# Altium project KOTROLER_TRANSPORTA.PrjPcb (part 1 of 2)
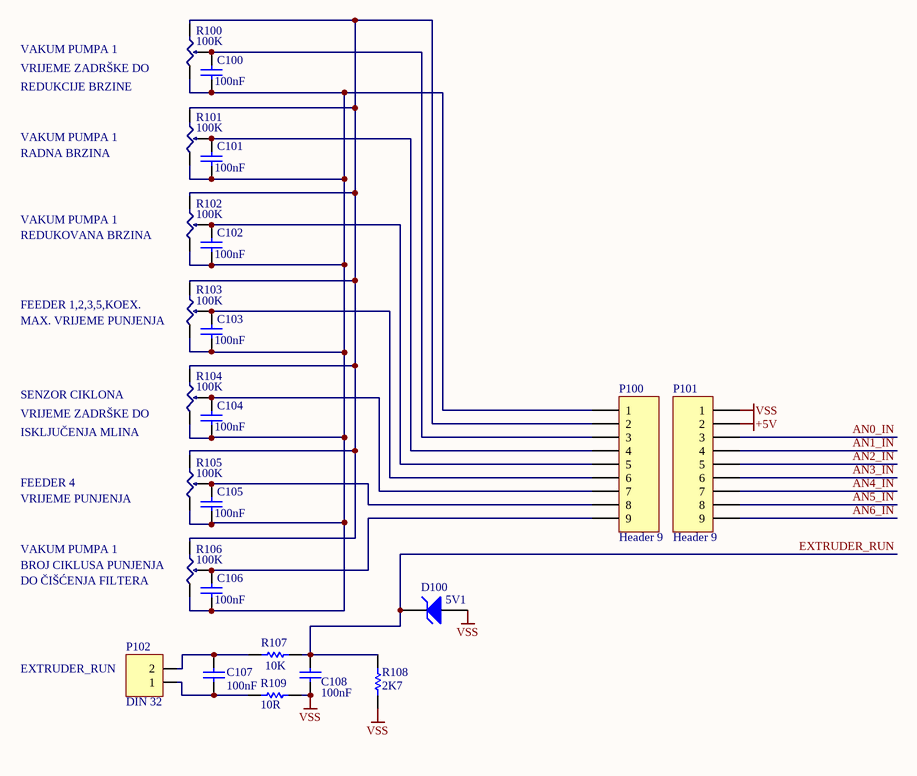
[diagram p0: ANALOG_INPUT.SchDoc]
8 sheets, 436 parts. Net scope: global (net labels, ports and power ports of the same name join across sheets).
Board file: KOTROLER_TRANSPORTA.PcbDoc
Sheets:
  ANALOG_INPUT.SchDoc
  ANALOG_OUTPUT.SchDoc
  CUC.SchDoc
  DIGITAL_INPUT.SchDoc
  DIGITAL_OUTPUT.SchDoc
  PSU.SchDoc
  SIGNAL_OUTPUT.SchDoc
  ERROR_DISPLAY.SchDoc

## Sheet ANALOG_INPUT.SchDoc: Analog input
size A4; Author: eldar6776@hotmail.com; DrawnBy: Eldar Dedic; Organization: PROVEN d.o.o.; Address1: Adema Buće 102; Address2: 71000 Sarajevo; Address3: Federacija BiH; Address4: Bosna i Hercegovina; DocumentNumber: CD-26514; Revision: 001; SheetNumber: 1; SheetTotal: 8; ProjectName: KONTROLER TRANSPORTA MATERIJALA

### Parts
C100  value 100nF  [1206]
C101  value 100nF  [1206]
C102  value 100nF  [1206]
C103  value 100nF  [1206]
C104  value 100nF  [1206]
C105  value 100nF  [1206]
C106  value 100nF  [1206]
C107  value 100nF  [1206]
C108  value 100nF  [1206]
D100  5V1  [SOD80C]
P100  Header 9  [HDR1X9]
P101  Header 9  [HDR1X9]
P102  DIN 32  [TERMINAL BLOK 2]
R100  100K  [Poti]
R101  100K  [Poti]
R102  100K  [Poti]
R103  100K  [Poti]
R104  100K  [Poti]
R105  100K  [Poti]
R106  100K  [Poti]
R107  10K  [ERA-0805]
R108  2K7  [ERA-0805]
R109  10R  [ERA-0805]

### Nets
+5V: P101.2
VSS: C108.2 D100.1(A) P101.1 R108.2 R109.1
AN0_IN: P101.3
AN1_IN: P101.4
AN2_IN: P101.5
AN3_IN: P101.6
AN4_IN: P101.7
AN5_IN: P101.8
AN6_IN: P101.9
EXTRUDER_RUN: C108.1 D100.2(K) R107.1 R108.1
NetC100_1: C100.1 C101.1 C102.1 C103.1 C104.1 C105.1 C106.1 P100.1 R100.2 R101.2 R102.2 R103.2 R104.2 R105.2 R106.2
NetC100_2: C100.2 P100.3 R100.3
NetC101_2: C101.2 P100.4 R101.3
NetC102_2: C102.2 P100.5 R102.3
NetC103_2: C103.2 P100.6 R103.3
NetC104_2: C104.2 P100.7 R104.3
NetC105_2: C105.2 P100.8 R105.3
NetC106_2: C106.2 P100.9 R106.3
NetC107_1: C107.1 P102.2 R107.2
NetC107_2: C107.2 P102.1 R109.2
NetP100_2: P100.2 R100.1 R101.1 R102.1 R103.1 R104.1 R105.1 R106.1

### Notes on the sheet
- VAKUM PUMPA 1
- VRIJEME ZADRŠKE DO
- REDUKCIJE BRZINE
- RADNA BRZINA
- REDUKOVANA BRZINA
- FEEDER 1,2,3,5,KOEX.
- MAX. VRIJEME PUNJENJA
- SENZOR CIKLONA
- ISKLJUČENJA MLINA
- FEEDER 4
- VRIJEME PUNJENJA
- BROJ CIKLUSA PUNJENJA
- DO ČIŠĆENJA FILTERA
- EXTRUDER_RUN
- Title
- Size:
- Date:
- A4
- Number:
- Time:
- Revision:
- Sheet
- of
- File:

### Library data of the parts
C100-C108 = C1206: Ceramic Chip Capacitor - Standard; Published: 17-Jul-2002; LatestRevisionDate: 19-Mar-2004; LatestRevisionNote: Silkscreen size reduced.; DatasheetDocument: Mar-2001; PackageDocument: Mar-2001; PackageReference: 1206; Publisher: Altium Limited; Code_JEITA: 1206; Code_IPC: 3216 [1206]; ComponentLink1Description: Manufacturer Link; ComponentLink1URL: http://www.kemet.com/; ComponentLink2Description: Datasheet; ComponentLink2URL: http://www.kemet.com/kemet/web/homepage/kechome.nsf/vapubfilesname/F3102TA.pdf/$file/F3102TA.pdf
D100 = D Zener: Zener Diode; Published: 8-Jun-2000; LatestRevisionDate: 17-Jul-2002; LatestRevisionNote: Re-released for DXP Platform.; PackageReference: DIODE-0.7; Publisher: Altium Limited; PackageDescription: Diode, Thru-Hole; 2 Leads; 0.7 in Pin Spacing
P100 P101 = Header 9: Header, 9-Pin; LatestRevisionDate: 17-Jul-2002; LatestRevisionNote: Re-released for DXP Platform.; Publisher: Altium Limited
P102 = Terminal blok 2 pina: Terminal blok 2
R100-R106 = POTI
R107-R109 = ERA6Y: Rectangular Thick Film Chip Resistor, 10 Ohm to 1M Ohm Range, 0.1% and 0.5% Tolerance, 0805 Size, 0.1 W; Note: If flow soldering, adjust pad width of PCB Footprint to 0.7 - 0.8 times the width of the resistor.; Published: 17-Dec-2003; LatestRevisionDate: 19-Mar-2004; LatestRevisionNote: Silkscreen size reduced.; PackageDocument: Mar-2003; PackageReference: ERA-0805; Publisher: Altium Limited; Code_IPC: 2012 [0805]; ComponentLink1Description: Manufacturer Link; ComponentLink1URL: http://www.panasonic.com/industrial/components/resistive_products.htm; ComponentLink2Description: Datasheet; ComponentLink2URL: http://www.panasonic.com/industrial/components/pdf/AOA0000CE8.pdf

## Sheet ANALOG_OUTPUT.SchDoc: Analog output
size A4; Author: eldar6776@hotmail.com; DrawnBy: Eldar Dedic; Organization: PROVEN d.o.o.; Address1: Adema Buće 102; Address2: 71000 Sarajevo; Address3: Federacija BiH; Address4: Bosna i Hercegovina; DocumentNumber: CD-26514; Revision: 001; SheetNumber: 2; SheetTotal: 8; ProjectName: KONTROLER TRANSPORTA MATERIJALA
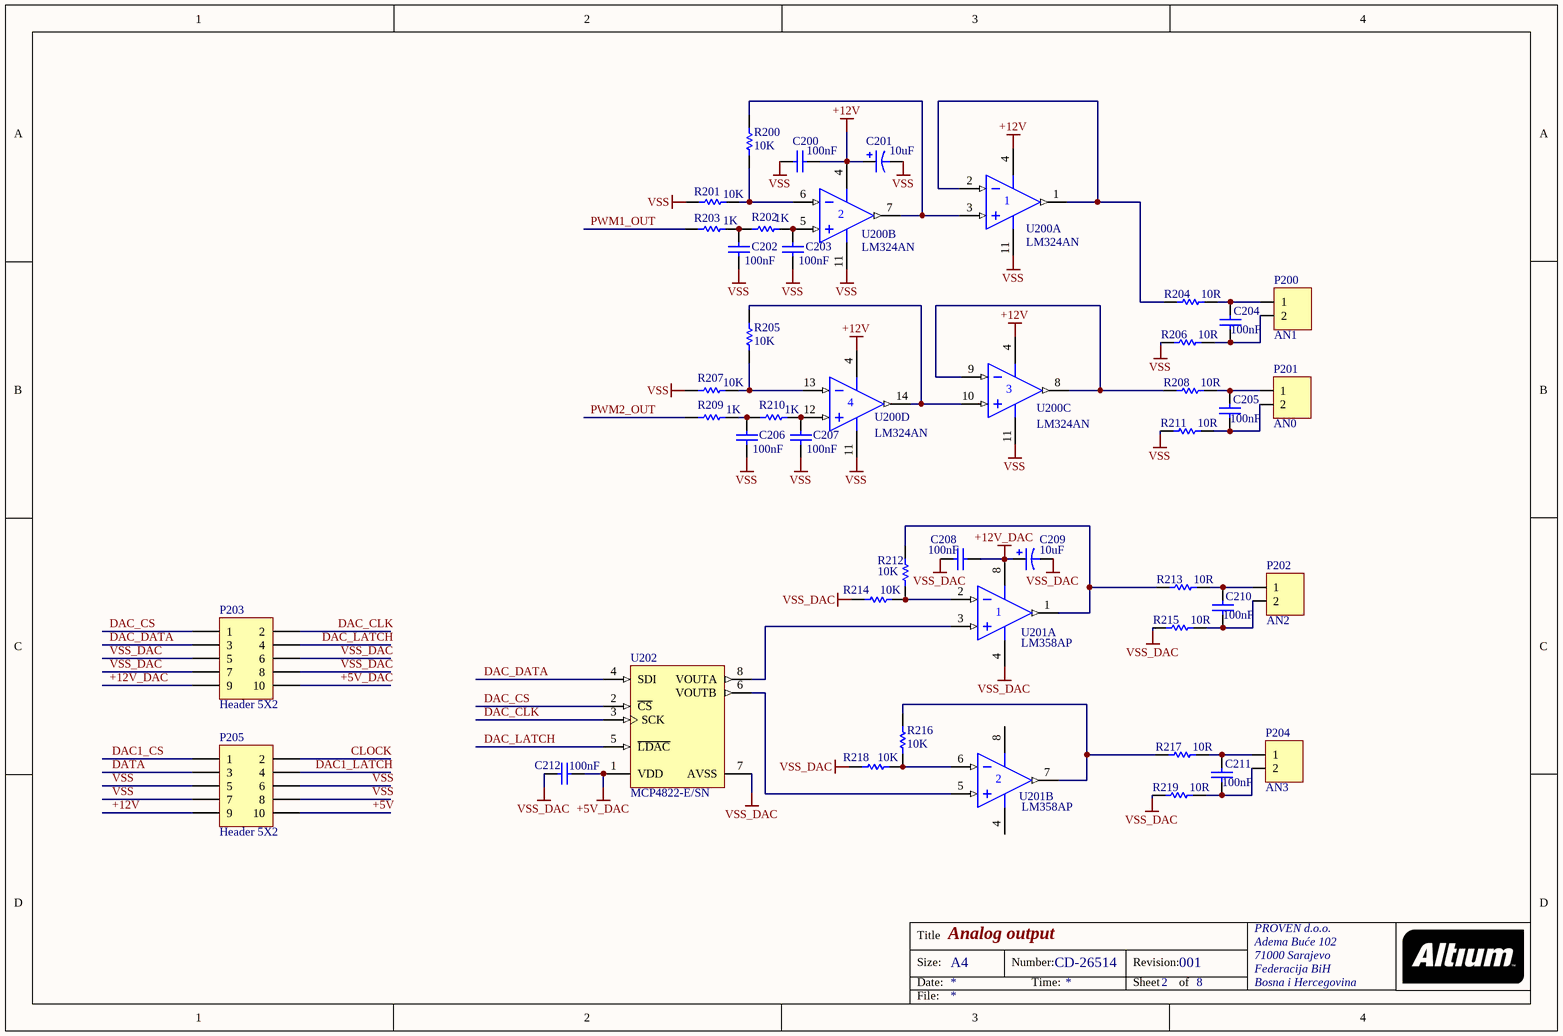
[diagram p1: ANALOG_OUTPUT.SchDoc]

### Parts
C200  value 100nF  [1206]
C201  10uF  [E]
C202  value 100nF  [1206]
C203  value 100nF  [1206]
C204  value 100nF  [1206]
C205  value 100nF  [1206]
C206  value 100nF  [1206]
C207  value 100nF  [1206]
C208  value 100nF  [1206]
C209  10uF  [CAPPR2.5-6.3X7]
C210  value 100nF  [1206]
C211  value 100nF  [1206]
C212  value 100nF  [1206]
P200  AN1  [TERMINAL BLOK 2]
P201  AN0  [TERMINAL BLOK 2]
P202  AN2  [TERMINAL BLOK 2]
P203  Header 5X2  [HDR2X5]
P204  AN3  [TERMINAL BLOK 2]
P205  Header 5X2  [HDR2X5]
R200  10K  [ERA-0805]
R201  10K  [ERA-0805]
R202  1K  [ERA-0805]
R203  1K  [ERA-0805]
R204  10R  [ERA-0805]
R205  10K  [ERA-0805]
R206  10R  [ERA-0805]
R207  10K  [ERA-0805]
R208  10R  [ERA-0805]
R209  1K  [ERA-0805]
R210  1K  [ERA-0805]
R211  10R  [ERA-0805]
R212  10K  [ERA-0805]
R213  10R  [ERA-0805]
R214  10K  [ERA-0805]
R215  10R  [ERA-0805]
R216  10K  [ERA-0805]
R217  10R  [ERA-0805]
R218  10K  [ERA-0805]
R219  10R  [ERA-0805]
U200  LM324AN  [N014]  (parts A,B,C,D of 4)
U201  LM358AP  [P008]  (parts A,B of 2)
U202  MCP4822-E/SN  [PDIP300-P8]

### Nets
+5V: P205.10
+5V_DAC: C212.2 P203.10 U202.1(VDD)
+12V: C200.2 C201.1 P205.9 U200.4(V+)
+12V_DAC: C208.2 C209.1 P203.9 U201.8(V+)
VSS: C200.1 C201.2 C202.1 C203.1 C206.1 C207.1 P205.5 P205.6 P205.7 P205.8 R201.1 R206.1 R207.1 R211.1 U200.11(V-)
VSS_DAC: C208.1 C209.2 C212.1 P203.5 P203.6 P203.7 P203.8 R214.2 R215.1 R218.2 R219.1 U201.4(V-) U202.7(AVSS)
CLOCK: P205.2
DAC1_CS: P205.1
DAC1_LATCH: P205.4
DAC_CLK: P203.2 U202.3(SCK)
DAC_CS: P203.1 U202.2(~{CS})
DAC_DATA: P203.3 U202.4(SDI)
DAC_LATCH: P203.4 U202.5(~{LDAC})
DATA: P205.3
PWM1_OUT: R203.1
PWM2_OUT: R209.1
NetC202_2: C202.2 R202.1 R203.2
NetC203_2: C203.2 R202.2 U200.5(IN+)
NetC204_1: C204.1 P200.2 R206.2
NetC204_2: C204.2 P200.1 R204.2
NetC205_1: C205.1 P201.2 R211.2
NetC205_2: C205.2 P201.1 R208.2
NetC206_2: C206.2 R209.2 R210.1
NetC207_2: C207.2 R210.2 U200.12(IN+)
NetC210_1: C210.1 P202.2 R215.2
NetC210_2: C210.2 P202.1 R213.2
NetC211_1: C211.1 P204.2 R219.2
NetC211_2: C211.2 P204.1 R217.2
NetR200_1: R200.1 R201.2 U200.6(IN-)
NetR200_2: R200.2 U200.3(IN+) U200.7(OUT)
NetR204_1: R204.1 U200.1(OUT) U200.2(IN-)
NetR205_1: R205.1 R207.2 U200.13(IN-)
NetR205_2: R205.2 U200.10(IN+) U200.14(OUT)
NetR208_1: R208.1 U200.8(OUT) U200.9(IN-)
NetR212_1: R212.1 R214.1 U201.2(IN-)
NetR212_2: R212.2 R213.1 U201.1(OUT)
NetR216_1: R216.1 R218.1 U201.6(IN-)
NetR216_2: R216.2 R217.1 U201.7(OUT)
NetU201_3: U201.3(IN+) U202.8(VOUTA)
NetU201_5: U201.5(IN+) U202.6(VOUTB)

### Notes on the sheet
- Title
- Size:
- Date:
- A4
- Number:
- Time:
- Revision:
- Sheet
- of
- File:

### Library data of the parts
C200 C202-C208 C210-C212 = C1206: Ceramic Chip Capacitor - Standard; Published: 17-Jul-2002; LatestRevisionDate: 19-Mar-2004; LatestRevisionNote: Silkscreen size reduced.; DatasheetDocument: Mar-2001; PackageDocument: Mar-2001; PackageReference: 1206; Publisher: Altium Limited; Code_JEITA: 1206; Code_IPC: 3216 [1206]; ComponentLink1Description: Manufacturer Link; ComponentLink1URL: http://www.kemet.com/; ComponentLink2Description: Datasheet; ComponentLink2URL: http://www.kemet.com/kemet/web/homepage/kechome.nsf/vapubfilesname/F3102TA.pdf/$file/F3102TA.pdf
C201 C209 = 94SA107X0010EBP: Solid Aluminum Capacitor with Organic Semiconductor Electrolyte: 100uF, 10V, Bulk Pack; Note: Part Numbers shown are for ± 20% capacitance tolerance (X0).; PCB_Layout: Complies with Manufacturer's Recommendation.; DrillSize: Nominal, Rounded to the nearest 0.1mm; Published: 19-Mar-2004; DatasheetDocument: 29-Jun-2001; PackageReference: E; Publisher: Altium Limited; ComponentLink1Description: Manufacturer Link; ComponentLink1URL: http://www.vishay.com/; ComponentLink2Description: Datasheet; ComponentLink2URL: http://www.vishay.com/docs/90003/94sa.pdf; Value: 100uF
P200-P202 P204 = Terminal blok 2 pina: Terminal blok 2
P203 P205 = Header 5X2: Header, 5-Pin, Dual row; LatestRevisionDate: 17-Jul-2002; LatestRevisionNote: Re-released for DXP Platform.; Publisher: Altium Limited
R200-R203 R205 R207 R209 R210 R212 R214 R216 R218 = ERAS: Metal Film Thermosensitive Chip Resistor, 0.56 Ohm to 10k Ohm Range, 5% Tolerance, 0805 Size, 0.1 W; Note: If flow soldering, adjust pad width of PCB Footprint to 0.7 - 0.8 times the width of the resistor.; Published: 17-Dec-2003; LatestRevisionDate: 19-Mar-2004; LatestRevisionNote: Silkscreen size reduced.; PackageDocument: Mar-2003; PackageReference: ERA-0805; Publisher: Altium Limited; Code_IPC: 2012 [0805]; ComponentLink1Description: Manufacturer Link; ComponentLink1URL: http://www.panasonic.com/industrial/components/resistive_products.htm; ComponentLink2Description: Datasheet; ComponentLink2URL: http://www.panasonic.com/industrial/components/pdf/AOF0000CE1.pdf
R204 R206 R208 R211 R213 R215 R217 R219 = ERA6Y: as R107 on sheet ANALOG_INPUT; Published: 17-Dec-2003; LatestRevisionDate: 19-Mar-2004; LatestRevisionNote: Silkscreen size reduced.; PackageDocument: Mar-2003; PackageReference: ERA-0805; Publisher: Altium Limited; Code_IPC: 2012 [0805]; ComponentLink1Description: Manufacturer Link; ComponentLink1URL: http://www.panasonic.com/industrial/components/resistive_products.htm; ComponentLink2Description: Datasheet; ComponentLink2URL: http://www.panasonic.com/industrial/components/pdf/AOA0000CE8.pdf
U200 = LM324AN: Quadruple Operational Amplifier; Published: 15-Apr-2002; LatestRevisionDate: 04-Mar-2005; LatestRevisionNote: Stylized 3D Model Added.; DatasheetVersion: Jan-1989; PackageVersion: Oct-1995; PackageReference: N014; Publisher: Altium Limited; PackageDescription: DIP; 14 Leads; Row Spacing 7.62 mm; Pitch 2.54 mm; ComponentLink1Description: Manufacturer Link; ComponentLink1URL: http://www.ti.com/; ComponentLink2Description: Datasheet; ComponentLink2URL: http://www-s.ti.com/sc/ds/lm324.pdf
U201 = LM358AP: Dual Operational Amplifier; Published: 15-Apr-2002; LatestRevisionDate: 04-Mar-2005; LatestRevisionNote: Stylized 3D Model Added.; DatasheetVersion: Aug-1988; PackageVersion: Jun-1999; PackageReference: P008; Publisher: Altium Limited; PackageDescription: DIP; 8 Leads; Row Spacing 7.62 mm; Pitch 2.54 mm; Code_JEDEC: MO-001-AN; ComponentLink1Description: Manufacturer Link; ComponentLink1URL: http://www.ti.com/; ComponentLink2Description: Datasheet; ComponentLink2URL: http://www-s.ti.com/sc/ds/lm358.pdf
U202 = MCP4822-E/SN: 12-Bit DACs with Internal VREF and SPI Interface, 8-Pin SOIC 150mil, Extended Temperature; Published: 29-Jan-2009; DatasheetVersion: revA, Jun-2005; PackageVersion: revBB, Aug-2009; PackageReference: SOIC-SN8; Publisher: Altium Limited; PackageDescription: 8-Lead Plastic Small Outline (SN) - Narrow, 3.90mm Body [SOIC]; Supplier 1: Digi-Key; Supplier Part Number 1: MCP4822-E/SN-ND; Supplier 2: Farnell; Supplier Part Number 2: 1439414; Code_JEDEC: MS-012; Code_IPC: SOIC127P600-8; ComponentLink1Description: Datasheet; ComponentLink1URL: http://ww1.microchip.com/downloads/en/DeviceDoc/21953a.pdf; ComponentLink2Description: Packaging Specification; ComponentLink2URL: http://www.microchip.com/stellent/groups/techpub_sg/documents/packagingspec/en012702.pdf; ComponentLink3Description: Microchip.com Home; ComponentLink3URL: http://www.microchip.com/

## Sheet CUC.SchDoc: Central microcontroller
size A4; Author: eldar6776@hotmail.com; DrawnBy: Eldar Dedic; Organization: PROVEN d.o.o.; Address1: Adema Buće 102; Address2: 71000 Sarajevo; Address3: Federacija BiH; Address4: Bosna i Hercegovina; DocumentNumber: CD-26514; Revision: 001; SheetNumber: 3; SheetTotal: 8; ProjectName: KONTROLER TRANSPORTA MATERIJALA
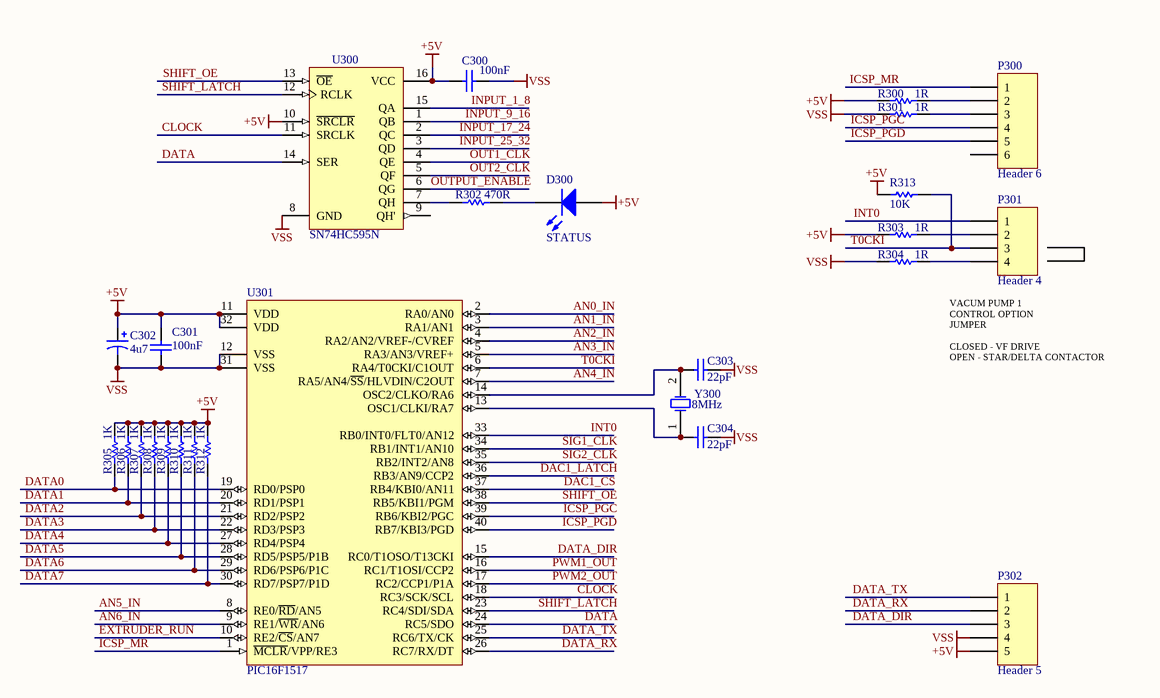
[diagram p2: CUC.SchDoc]

### Parts
C300  value 100nF  [1206]
C301  value 100nF  [1206]
C302  4u7  [94SP-C]
C303  value 22pF  [0402]
C304  value 22pF  [0402]
D300  STATUS  [3.5X2.8X1.9]
P300  Header 6  [HDR1X6]
P301  Header 4  [HDR1X4]
P302  Header 5  [HDR1X5]
R300  1R  [ERA-0805]
R301  1R  [ERA-0805]
R302  470R  [ERA-0805]
R303  1R  [ERA-0805]
R304  1R  [ERA-0805]
R305  1K  [ERA-0805]
R306  1K  [ERA-0805]
R307  1K  [ERA-0805]
R308  1K  [ERA-0805]
R309  1K  [ERA-0805]
R310  1K  [ERA-0805]
R311  1K  [ERA-0805]
R312  1K  [ERA-0805]
R313  10K  [ERA-0603]
U300  SN74HC595N  [N016]
U301  PIC16F1517  [PDIP600-P40]
Y300  8MHz  [HC49/4H_SMX]

### Nets
+5V: C300.1 C301.2 C302.1 D300.1(A) P302.5 R300.1 R303.1 R305.2 R306.2 R307.2 R308.2 R309.2 R310.2 R311.2 R312.2 R313.2 U300.10(~{SRCLR}) U300.16(VCC) U301.11(VDD) U301.32(VDD)
VSS: C300.2 C301.1 C302.2 C303.1 C304.1 P302.4 R301.1 R304.1 U300.8(GND) U301.12(VSS) U301.31(VSS)
AN0_IN: U301.2(RA0/AN0)
AN1_IN: U301.3(RA1/AN1)
AN2_IN: U301.4(RA2/AN2/VREF-/CVREF)
AN3_IN: U301.5(RA3/AN3/VREF+)
AN4_IN: U301.7(RA5/AN4/~{SS}/HLVDIN/C2OUT)
AN5_IN: U301.8(RE0/~{RD}/AN5)
AN6_IN: U301.9(RE1/~{WR}/AN6)
CLOCK: U300.11(SRCLK) U301.18(RC3/SCK/SCL)
DAC1_CS: U301.37(RB4/KBI0/AN11)
DAC1_LATCH: U301.36(RB3/AN9/CCP2)
DATA: U300.14(SER) U301.24(RC5/SDO)
DATA0: R305.1 U301.19(RD0/PSP0)
DATA1: R306.1 U301.20(RD1/PSP1)
DATA2: R307.1 U301.21(RD2/PSP2)
DATA3: R308.1 U301.22(RD3/PSP3)
DATA4: R309.1 U301.27(RD4/PSP4)
DATA5: R310.1 U301.28(RD5/PSP5/P1B)
DATA6: R311.1 U301.29(RD6/PSP6/P1C)
DATA7: R312.1 U301.30(RD7/PSP7/P1D)
DATA_DIR: P302.3 U301.15(RC0/T1OSO/T13CKI)
DATA_RX: P302.2 U301.26(RC7/RX/DT)
DATA_TX: P302.1 U301.25(RC6/TX/CK)
EXTRUDER_RUN: U301.10(RE2/~{CS}/AN7)
ICSP_MR: P300.1 U301.1(~{MCLR}/VPP/RE3)
ICSP_PGC: P300.4 U301.39(RB6/KBI2/PGC)
ICSP_PGD: P300.5 U301.40(RB7/KBI3/PGD)
INPUT_1_8: U300.15(QA)
INPUT_9_16: U300.1(QB)
INPUT_17_24: U300.2(QC)
INPUT_25_32: U300.3(QD)
INT0: P301.1 U301.33(RB0/INT0/FLT0/AN12)
OUT1_CLK: U300.4(QE)
OUT2_CLK: U300.5(QF)
OUTPUT_ENABLE: U300.6(QG)
PWM1_OUT: U301.16(RC1/T1OSI/CCP2)
PWM2_OUT: U301.17(RC2/CCP1/P1A)
SHIFT_LATCH: U300.12(RCLK) U301.23(RC4/SDI/SDA)
SHIFT_OE: U300.13(~{OE}) U301.38(RB5/KBI1/PGM)
SIG1_CLK: U301.34(RB1/INT1/AN10)
SIG2_CLK: U301.35(RB2/INT2/AN8)
T0CKI: P301.3 R313.1 U301.6(RA4/T0CKI/C1OUT)
NetC303_2: C303.2 U301.14(OSC2/CLKO/RA6) Y300.2(OSC2)
NetC304_2: C304.2 U301.13(OSC1/CLKI/RA7) Y300.1(OSC1)
NetD300_2: D300.2(K) R302.2
NetP300_2: P300.2 R300.2
NetP300_3: P300.3 R301.2
NetP301_2: P301.2 R303.2
NetP301_4: P301.4 R304.2
NetR302_1: R302.1 U300.7(QH)

Not connected (* = marked no-connect by the designer): P300 6; U300 9(QH')

### Notes on the sheet
- VACUM PUMP 1
  CONTROL OPTION
  JUMPER
  CLOSED - VF DRIVE
  OPEN - STAR/DELTA CONTACTOR
- Title
- Size:
- Date:
- A4
- Number:
- Time:
- Revision:
- Sheet
- of
- File:

### Library data of the parts
C300 C301 = C1206: Ceramic Chip Capacitor - Standard; Published: 17-Jul-2002; LatestRevisionDate: 19-Mar-2004; LatestRevisionNote: Silkscreen size reduced.; DatasheetDocument: Mar-2001; PackageDocument: Mar-2001; PackageReference: 1206; Publisher: Altium Limited; Code_JEITA: 1206; Code_IPC: 3216 [1206]; ComponentLink1Description: Manufacturer Link; ComponentLink1URL: http://www.kemet.com/; ComponentLink2Description: Datasheet; ComponentLink2URL: http://www.kemet.com/kemet/web/homepage/kechome.nsf/vapubfilesname/F3102TA.pdf/$file/F3102TA.pdf
C302 = 94SA107X0010EBP: as C201 on sheet ANALOG_OUTPUT; Published: 19-Mar-2004; DatasheetDocument: 29-Jun-2001; PackageReference: E; Publisher: Altium Limited; ComponentLink1Description: Manufacturer Link; ComponentLink1URL: http://www.vishay.com/; ComponentLink2Description: Datasheet; ComponentLink2URL: http://www.vishay.com/docs/90003/94sa.pdf; Value: 100uF
C303 C304 = C0402: Ceramic Chip Capacitor - Standard; Note: Footprint corresponds to dimensions for bulk cassette packaging. This case size has tightened tolerances.; Published: 17-Jul-2002; LatestRevisionDate: 19-Mar-2004; LatestRevisionNote: Silkscreen size reduced.; DatasheetDocument: Mar-2001; PackageDocument: Mar-2001; PackageReference: 0402; Publisher: Altium Limited; Code_JEITA: 0402; Code_IPC: 1005 [0402]; ComponentLink1Description: Manufacturer Link; ComponentLink1URL: http://www.kemet.com/; ComponentLink2Description: Datasheet; ComponentLink2URL: http://www.kemet.com/kemet/web/homepage/kechome.nsf/vapubfilesname/F3102TA.pdf/$file/F3102TA.pdf
D300 = LED3: Typical BLUE SiC LED; Published: 8-Jun-2000; LatestRevisionDate: 17-Dec-2003; LatestRevisionNote: PCB Footprint replaced.; DatasheetVersion: 16-Apr-2002; PackageVersion: 16-Apr-2002; PackageReference: 3.5X2.8X1.9; Publisher: Altium Limited; PackageDescription: SM LED; 2 C-Bend Leads; Body 3.5 x 2.8 x 1.9 mm, inc leads (LxWxH typ)
P300 = Header 6: Header, 6-Pin; LatestRevisionDate: 17-Jul-2002; LatestRevisionNote: Re-released for DXP Platform.; Publisher: Altium Limited
P301 = Header 4: Header, 4-Pin; LatestRevisionDate: 17-Jul-2002; LatestRevisionNote: Re-released for DXP Platform.; Publisher: Altium Limited
P302 = Header 5: Header, 5-Pin; LatestRevisionDate: 17-Jul-2002; LatestRevisionNote: Re-released for DXP Platform.; Publisher: Altium Limited
R300-R312 = ERA6Y: as R107 on sheet ANALOG_INPUT; Published: 17-Dec-2003; LatestRevisionDate: 19-Mar-2004; LatestRevisionNote: Silkscreen size reduced.; PackageDocument: Mar-2003; PackageReference: ERA-0805; Publisher: Altium Limited; Code_IPC: 2012 [0805]; ComponentLink1Description: Manufacturer Link; ComponentLink1URL: http://www.panasonic.com/industrial/components/resistive_products.htm; ComponentLink2Description: Datasheet; ComponentLink2URL: http://www.panasonic.com/industrial/components/pdf/AOA0000CE8.pdf
R313 = ERA3Y: Rectangular Thick Film Chip Resistor, 10 Ohm to 330k Ohm Range, 0.1% and 0.5% Tolerance, 0603 Size, 0.063 W; Note: If flow soldering, adjust pad width of PCB Footprint to 0.7 - 0.8 times the width of the resistor.; Published: 17-Dec-2003; LatestRevisionDate: 19-Mar-2004; LatestRevisionNote: Silkscreen size reduced.; PackageDocument: Mar-2003; PackageReference: ERA-0603; Publisher: Altium Limited; Code_IPC: 1608 [0603]; ComponentLink1Description: Manufacturer Link; ComponentLink1URL: http://www.panasonic.com/industrial/components/resistive_products.htm; ComponentLink2Description: Datasheet; ComponentLink2URL: http://www.panasonic.com/industrial/components/pdf/AOA0000CE8.pdf
U300 = SN74HC595N: 8-Bit Shift Register with 3-State Output Registers; Published: 8-Jun-2000; LatestRevisionDate: 04-Mar-2005; LatestRevisionNote: Stylized 3D Model Added.; DatasheetVersion: May-1997; PackageVersion: Oct-1995; PackageReference: N016; Publisher: Altium Limited; PackageDescription: DIP; 16 Leads; Row Spacing 7.62 mm; Pitch 2.54 mm; Code_JEDEC: MS-001-BB; ComponentLink1Description: Manufacturer Link; ComponentLink1URL: http://www.ti.com/; ComponentLink2Description: Datasheet; ComponentLink2URL: http://www-s.ti.com/sc/ds/sn74hc595.pdf
U301 = PIC18F4520-E/P: Enhanced Flash Microcontroller with 10-Bit A/D and nanoWatt Technology, 32K Flash, 40-Pin PDIP, Extended Temperature Range; Published: 29-Jan-2009; LatestRevisionDate: 02-Dec-2009; LatestRevisionNote: Updated to datasheet revision E, Oct-2008; DatasheetVersion: revE, Oct-2008; PackageVersion: revBB, Aug-2009; PackageReference: PDIP600-P40; Publisher: Altium Limited; PackageDescription: 40-Lead Plastic Dual In-Line (P) - 600 mil Body [PDIP]; Supplier 1: Digi-Key; Supplier Part Number 1: PIC18F4520-E/P-ND; ComponentLink1Description: Datasheet; ComponentLink1URL: http://ww1.microchip.com/downloads/en/DeviceDoc/39631E.pdf; ComponentLink2Description: Packaging Specification; ComponentLink2URL: http://www.microchip.com/stellent/groups/techpub_sg/documents/packagingspec/en012702.pdf; ComponentLink3Description: Microchip.com Home; ComponentLink3URL: http://www.microchip.com/
Y300 = HC49/4H_SMX: Surface Mount Quartz Crystal; Note: PCB layout complies with manufacturer's recommendation.; Published: 17-Jul-2002; DatasheetDocument: 18-Oct-1999; PackageDocument: 18-Oct-1999; PackageReference: HC49/4H_SMX; Publisher: Altium Limited; ComponentLink1Description: Manufacturer Link; ComponentLink1URL: http://www.cmac.com/mt/; ComponentLink2Description: Datasheet; ComponentLink2URL: http://www.cmac.com/mt/databook/crystals/smd/hc49_4h_smx.pdf

## Sheet DIGITAL_INPUT.SchDoc: Digital input
size A3; Author: eldar6776@hotmail.com; DrawnBy: Eldar Dedic; Organization: PROVEN d.o.o.; Address1: Adema Buće 102; Address2: 71000 Sarajevo; Address3: Federacija BiH; Address4: Bosna i Hercegovina; DocumentNumber: CD-26514; Revision: 001; SheetNumber: 4; SheetTotal: 8; ProjectName: KONTROLER TRANSPORTA MATERIJALA
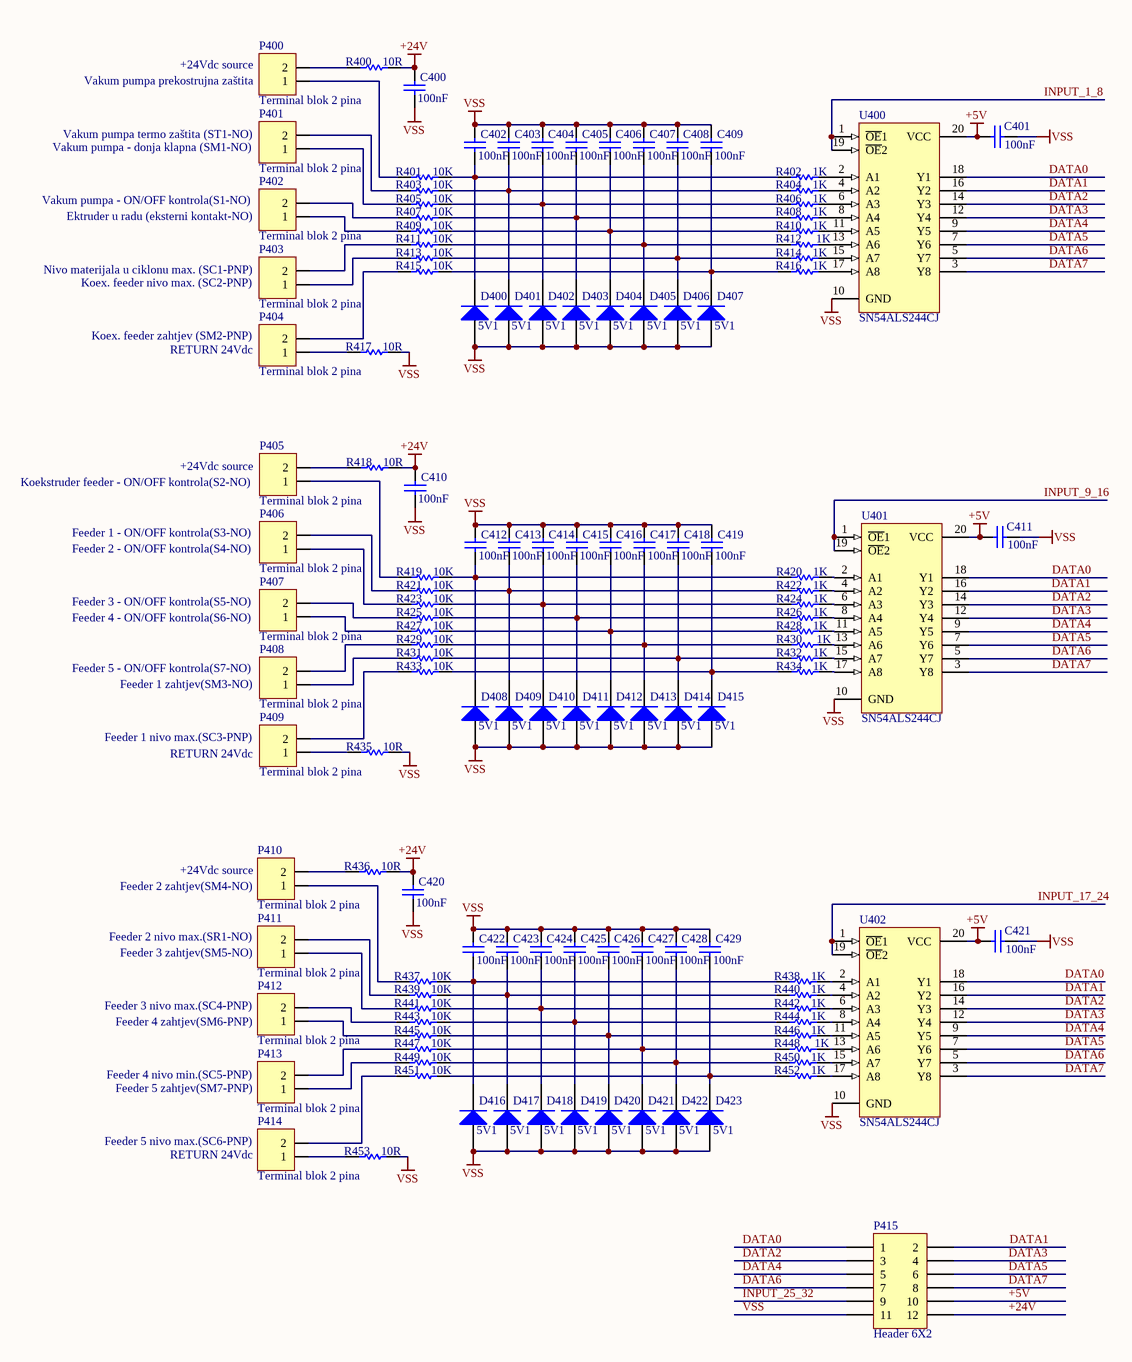
[diagram p3: DIGITAL_INPUT.SchDoc]

### Parts
C400  value 100nF  [1206]
C401  value 100nF  [1206]
C402  value 100nF  [1206]
C403  value 100nF  [1206]
C404  value 100nF  [1206]
C405  value 100nF  [1206]
C406  value 100nF  [1206]
C407  value 100nF  [1206]
C408  value 100nF  [1206]
C409  value 100nF  [1206]
C410  value 100nF  [1206]
C411  value 100nF  [1206]
C412  value 100nF  [1206]
C413  value 100nF  [1206]
C414  value 100nF  [1206]
C415  value 100nF  [1206]
C416  value 100nF  [1206]
C417  value 100nF  [1206]
C418  value 100nF  [1206]
C419  value 100nF  [1206]
C420  value 100nF  [1206]
C421  value 100nF  [1206]
C422  value 100nF  [1206]
C423  value 100nF  [1206]
C424  value 100nF  [1206]
C425  value 100nF  [1206]
C426  value 100nF  [1206]
C427  value 100nF  [1206]
C428  value 100nF  [1206]
C429  value 100nF  [1206]
D400  5V1  [SOD80C]
D401  5V1  [SOD80C]
D402  5V1  [SOD80C]
D403  5V1  [SOD80C]
D404  5V1  [SOD80C]
D405  5V1  [SOD80C]
D406  5V1  [SOD80C]
D407  5V1  [SOD80C]
D408  5V1  [SOD80C]
D409  5V1  [SOD80C]
D410  5V1  [SOD80C]
D411  5V1  [SOD80C]
D412  5V1  [SOD80C]
D413  5V1  [SOD80C]
D414  5V1  [SOD80C]
D415  5V1  [SOD80C]
D416  5V1  [SOD80C]
D417  5V1  [SOD80C]
D418  5V1  [SOD80C]
D419  5V1  [SOD80C]
D420  5V1  [SOD80C]
D421  5V1  [SOD80C]
D422  5V1  [SOD80C]
D423  5V1  [SOD80C]
P400  Terminal blok 2 pina  [TERMINAL BLOK 2]
P401  Terminal blok 2 pina  [TERMINAL BLOK 2]
P402  Terminal blok 2 pina  [TERMINAL BLOK 2]
P403  Terminal blok 2 pina  [TERMINAL BLOK 2]
P404  Terminal blok 2 pina  [TERMINAL BLOK 2]
P405  Terminal blok 2 pina  [TERMINAL BLOK 2]
P406  Terminal blok 2 pina  [TERMINAL BLOK 2]
P407  Terminal blok 2 pina  [TERMINAL BLOK 2]
P408  Terminal blok 2 pina  [TERMINAL BLOK 2]
P409  Terminal blok 2 pina  [TERMINAL BLOK 2]
P410  Terminal blok 2 pina  [TERMINAL BLOK 2]
P411  Terminal blok 2 pina  [TERMINAL BLOK 2]
P412  Terminal blok 2 pina  [TERMINAL BLOK 2]
P413  Terminal blok 2 pina  [TERMINAL BLOK 2]
P414  Terminal blok 2 pina  [TERMINAL BLOK 2]
P415  Header 6X2  [HDR2X6]
R400  10R  [ERA-0805]
R401  10K  [ERA-0805]
R402  1K  [ERA-0805]
R403  10K  [ERA-0805]
R404  1K  [ERA-0805]
R405  10K  [ERA-0805]
R406  1K  [ERA-0805]
R407  10K  [ERA-0805]
R408  1K  [ERA-0805]
R409  10K  [ERA-0805]
R410  1K  [ERA-0805]
R411  10K  [ERA-0805]
R412  1K  [ERA-0805]
R413  10K  [ERA-0805]
R414  1K  [ERA-0805]
R415  10K  [ERA-0805]
R416  1K  [ERA-0805]
R417  10R  [ERA-0805]
R418  10R  [ERA-0805]
R419  10K  [ERA-0805]
R420  1K  [ERA-0805]
R421  10K  [ERA-0805]
R422  1K  [ERA-0805]
R423  10K  [ERA-0805]
R424  1K  [ERA-0805]
R425  10K  [ERA-0805]
R426  1K  [ERA-0805]
R427  10K  [ERA-0805]
R428  1K  [ERA-0805]
R429  10K  [ERA-0805]
R430  1K  [ERA-0805]
R431  10K  [ERA-0805]
R432  1K  [ERA-0805]
R433  10K  [ERA-0805]
R434  1K  [ERA-0805]
R435  10R  [ERA-0805]
R436  10R  [ERA-0805]
R437  10K  [ERA-0805]
R438  1K  [ERA-0805]
R439  10K  [ERA-0805]
R440  1K  [ERA-0805]
R441  10K  [ERA-0805]
R442  1K  [ERA-0805]
R443  10K  [ERA-0805]
R444  1K  [ERA-0805]
R445  10K  [ERA-0805]
R446  1K  [ERA-0805]
R447  10K  [ERA-0805]
R448  1K  [ERA-0805]
R449  10K  [ERA-0805]
R450  1K  [ERA-0805]
R451  10K  [ERA-0805]
R452  1K  [ERA-0805]
R453  10R  [ERA-0805]
U400  SN54ALS244CJ  [J020]
U401  SN54ALS244CJ  [J020]
U402  SN54ALS244CJ  [J020]

### Nets
+5V: C401.1 C411.1 C421.1 P415.10 U400.20(VCC) U401.20(VCC) U402.20(VCC)
+24V: C400.2 C410.2 C420.2 P415.12 R400.2 R418.2 R436.2
VSS: C400.1 C401.2 C402.2 C403.2 C404.2 C405.2 C406.2 C407.2 C408.2 C409.2 C410.1 C411.2 C412.2 C413.2 C414.2 C415.2 C416.2 C417.2 C418.2 C419.2 C420.1 C421.2 C422.2 C423.2 C424.2 C425.2 C426.2 C427.2 C428.2 C429.2 D400.1(A) D401.1(A) D402.1(A) D403.1(A) D404.1(A) D405.1(A) D406.1(A) D407.1(A) D408.1(A) D409.1(A) D410.1(A) D411.1(A) D412.1(A) D413.1(A) D414.1(A) D415.1(A) D416.1(A) D417.1(A) D418.1(A) D419.1(A) D420.1(A) D421.1(A) D422.1(A) D423.1(A) P415.11 R417.2 R435.2 R453.2 U400.10(GND) U401.10(GND) U402.10(GND)
DATA0: P415.1 U400.18(Y1) U401.18(Y1) U402.18(Y1)
DATA1: P415.2 U400.16(Y2) U401.16(Y2) U402.16(Y2)
DATA2: P415.3 U400.14(Y3) U401.14(Y3) U402.14(Y3)
DATA3: P415.4 U400.12(Y4) U401.12(Y4) U402.12(Y4)
DATA4: P415.5 U400.9(Y5) U401.9(Y5) U402.9(Y5)
DATA5: P415.6 U400.7(Y6) U401.7(Y6) U402.7(Y6)
DATA6: P415.7 U400.5(Y7) U401.5(Y7) U402.5(Y7)
DATA7: P415.8 U400.3(Y8) U401.3(Y8) U402.3(Y8)
INPUT_1_8: U400.1(~{OE}1) U400.19(~{OE}2)
INPUT_9_16: U401.1(~{OE}1) U401.19(~{OE}2)
INPUT_17_24: U402.1(~{OE}1) U402.19(~{OE}2)
INPUT_25_32: P415.9
NetC402_1: C402.1 D400.2(K) R401.2 R402.1
NetC403_1: C403.1 D401.2(K) R403.2 R404.1
NetC404_1: C404.1 D402.2(K) R405.2 R406.1
NetC405_1: C405.1 D403.2(K) R407.2 R408.1
NetC406_1: C406.1 D404.2(K) R409.2 R410.1
NetC407_1: C407.1 D405.2(K) R411.2 R412.1
NetC408_1: C408.1 D406.2(K) R413.2 R414.1
NetC409_1: C409.1 D407.2(K) R415.2 R416.1
NetC412_1: C412.1 D408.2(K) R419.2 R420.1
NetC413_1: C413.1 D409.2(K) R421.2 R422.1
NetC414_1: C414.1 D410.2(K) R423.2 R424.1
NetC415_1: C415.1 D411.2(K) R425.2 R426.1
NetC416_1: C416.1 D412.2(K) R427.2 R428.1
NetC417_1: C417.1 D413.2(K) R429.2 R430.1
NetC418_1: C418.1 D414.2(K) R431.2 R432.1
NetC419_1: C419.1 D415.2(K) R433.2 R434.1
NetC422_1: C422.1 D416.2(K) R437.2 R438.1
NetC423_1: C423.1 D417.2(K) R439.2 R440.1
NetC424_1: C424.1 D418.2(K) R441.2 R442.1
NetC425_1: C425.1 D419.2(K) R443.2 R444.1
NetC426_1: C426.1 D420.2(K) R445.2 R446.1
NetC427_1: C427.1 D421.2(K) R447.2 R448.1
NetC428_1: C428.1 D422.2(K) R449.2 R450.1
NetC429_1: C429.1 D423.2(K) R451.2 R452.1
NetP400_1: P400.1 R401.1
NetP400_2: P400.2 R400.1
NetP401_1: P401.1 R405.1
NetP401_2: P401.2 R403.1
NetP402_1: P402.1 R409.1
NetP402_2: P402.2 R407.1
NetP403_1: P403.1 R413.1
NetP403_2: P403.2 R411.1
NetP404_1: P404.1 R417.1
NetP404_2: P404.2 R415.1
NetP405_1: P405.1 R419.1
NetP405_2: P405.2 R418.1
NetP406_1: P406.1 R423.1
NetP406_2: P406.2 R421.1
NetP407_1: P407.1 R427.1
NetP407_2: P407.2 R425.1
NetP408_1: P408.1 R431.1
NetP408_2: P408.2 R429.1
NetP409_1: P409.1 R435.1
NetP409_2: P409.2 R433.1
NetP410_1: P410.1 R437.1
NetP410_2: P410.2 R436.1
NetP411_1: P411.1 R441.1
NetP411_2: P411.2 R439.1
NetP412_1: P412.1 R445.1
NetP412_2: P412.2 R443.1
NetP413_1: P413.1 R449.1
NetP413_2: P413.2 R447.1
NetP414_1: P414.1 R453.1
NetP414_2: P414.2 R451.1
NetR402_2: R402.2 U400.2(A1)
NetR404_2: R404.2 U400.4(A2)
NetR406_2: R406.2 U400.6(A3)
NetR408_2: R408.2 U400.8(A4)
NetR410_2: R410.2 U400.11(A5)
NetR412_2: R412.2 U400.13(A6)
NetR414_2: R414.2 U400.15(A7)
NetR416_2: R416.2 U400.17(A8)
NetR420_2: R420.2 U401.2(A1)
NetR422_2: R422.2 U401.4(A2)
NetR424_2: R424.2 U401.6(A3)
NetR426_2: R426.2 U401.8(A4)
NetR428_2: R428.2 U401.11(A5)
NetR430_2: R430.2 U401.13(A6)
NetR432_2: R432.2 U401.15(A7)
NetR434_2: R434.2 U401.17(A8)
NetR438_2: R438.2 U402.2(A1)
NetR440_2: R440.2 U402.4(A2)
NetR442_2: R442.2 U402.6(A3)
NetR444_2: R444.2 U402.8(A4)
NetR446_2: R446.2 U402.11(A5)
NetR448_2: R448.2 U402.13(A6)
NetR450_2: R450.2 U402.15(A7)
NetR452_2: R452.2 U402.17(A8)

### Notes on the sheet
- (near P400) Vakum pumpa prekostrujna zaštita
- (near P400) +24Vdc source
- (near P401) Vakum pumpa - donja klapna (SM1-NO)
- (near P401) Vakum pumpa termo zaštita (ST1-NO)
- (near P402) Vakum pumpa - ON/OFF kontrola(S1-NO)
- (near P402) Ektruder u radu (eksterni kontakt-NO)
- (near P403) Nivo materijala u ciklonu max. (SC1-PNP)
- (near P403) Koex. feeder nivo max. (SC2-PNP)
- (near P404) Koex. feeder zahtjev (SM2-PNP)
- RETURN 24Vdc
- (near P405) Koekstruder feeder - ON/OFF kontrola(S2-NO)
- (near P405) +24Vdc source
- (near P406) Feeder 1 - ON/OFF kontrola(S3-NO)
- (near P406) Feeder 2 - ON/OFF kontrola(S4-NO)
- (near P407) Feeder 3 - ON/OFF kontrola(S5-NO)
- (near P407) Feeder 4 - ON/OFF kontrola(S6-NO)
- (near P408) Feeder 5 - ON/OFF kontrola(S7-NO)
- (near P408) Feeder 1 zahtjev(SM3-NO)
- (near P409) Feeder 1 nivo max.(SC3-PNP)
- (near P410) Feeder 2 zahtjev(SM4-NO)
- (near P410) +24Vdc source
- (near P411) Feeder 2 nivo max.(SR1-NO)
- (near P411) Feeder 3 zahtjev(SM5-NO)
- (near P412) Feeder 3 nivo max.(SC4-PNP)
- (near P412) Feeder 4 zahtjev(SM6-PNP)
- (near P413) Feeder 4 nivo min.(SC5-PNP)
- (near P413) Feeder 5 zahtjev(SM7-PNP)
- (near P414) Feeder 5 nivo max.(SC6-PNP)
- Title
- Size:
- Date:
- A3
- Number:
- Time:
- Revision:
- Sheet
- of
- File:

### Library data of the parts
C400-C429 = C1206: Ceramic Chip Capacitor - Standard; Published: 17-Jul-2002; LatestRevisionDate: 19-Mar-2004; LatestRevisionNote: Silkscreen size reduced.; DatasheetDocument: Mar-2001; PackageDocument: Mar-2001; PackageReference: 1206; Publisher: Altium Limited; Code_JEITA: 1206; Code_IPC: 3216 [1206]; ComponentLink1Description: Manufacturer Link; ComponentLink1URL: http://www.kemet.com/; ComponentLink2Description: Datasheet; ComponentLink2URL: http://www.kemet.com/kemet/web/homepage/kechome.nsf/vapubfilesname/F3102TA.pdf/$file/F3102TA.pdf
D400-D423 = BZV85-C5V1: Voltage Regulator Diode; Published: 17-Sep-2003; DatasheetVersion: 11-May-1999; PackageVersion: May-1999; PackageReference: SOD66; Publisher: Altium Limited; PackageDescription: Diode, Axial; Body 4.8 x 2.6 mm (LxDia. max), Lead Dia. 0.81 mm (max); Code_JEDEC: DO-204-AL; ComponentLink1Description: Manufacturer Link; ComponentLink1URL: http://www.semiconductors.philips.com/; ComponentLink2Description: Datasheet; ComponentLink2URL: http://www.semiconductors.philips.com/acrobat/datasheets/BZV85_2.pdf
P400-P414 = Terminal blok 2 pina: Terminal blok 2
P415 = Header 6X2: Header, 6-Pin, Dual row; LatestRevisionDate: 17-Jul-2002; LatestRevisionNote: Re-released for DXP Platform.; Publisher: Altium Limited
R400-R453 = ERA6Y: as R107 on sheet ANALOG_INPUT; Published: 17-Dec-2003; LatestRevisionDate: 19-Mar-2004; LatestRevisionNote: Silkscreen size reduced.; PackageDocument: Mar-2003; PackageReference: ERA-0805; Publisher: Altium Limited; Code_IPC: 2012 [0805]; ComponentLink1Description: Manufacturer Link; ComponentLink1URL: http://www.panasonic.com/industrial/components/resistive_products.htm; ComponentLink2Description: Datasheet; ComponentLink2URL: http://www.panasonic.com/industrial/components/pdf/AOA0000CE8.pdf
U400-U402 = SN54ALS244CJ: Octal Buffer/Driver with 3-State Outputs; Published: 8-Jun-2000; LatestRevisionDate: 06-Jun-2005; LatestRevisionNote: Stylized 3D Model Added.; DatasheetVersion: Aug-1995; PackageVersion: Jun-1999; PackageReference: J020; Publisher: Altium Limited; PackageDescription: DIP; 20 Leads; Row Spacing 7.62 mm; Pitch 2.54 mm; ComponentLink1Description: Manufacturer Link; ComponentLink1URL: http://www.ti.com/; ComponentLink2Description: Datasheet; ComponentLink2URL: http://www-s.ti.com/sc/ds/sn74als244c.pdf

## Sheet DIGITAL_OUTPUT.SchDoc: Digital output
size A3; Author: eldar6776@hotmail.com; DrawnBy: Eldar Dedic; Organization: PROVEN d.o.o.; Address1: Adema Buće 102; Address2: 71000 Sarajevo; Address3: Federacija BiH; Address4: Bosna i Hercegovina; DocumentNumber: CD-26514; Revision: 001; SheetNumber: 5; SheetTotal: 8; ProjectName: KONTROLER TRANSPORTA MATERIJALA
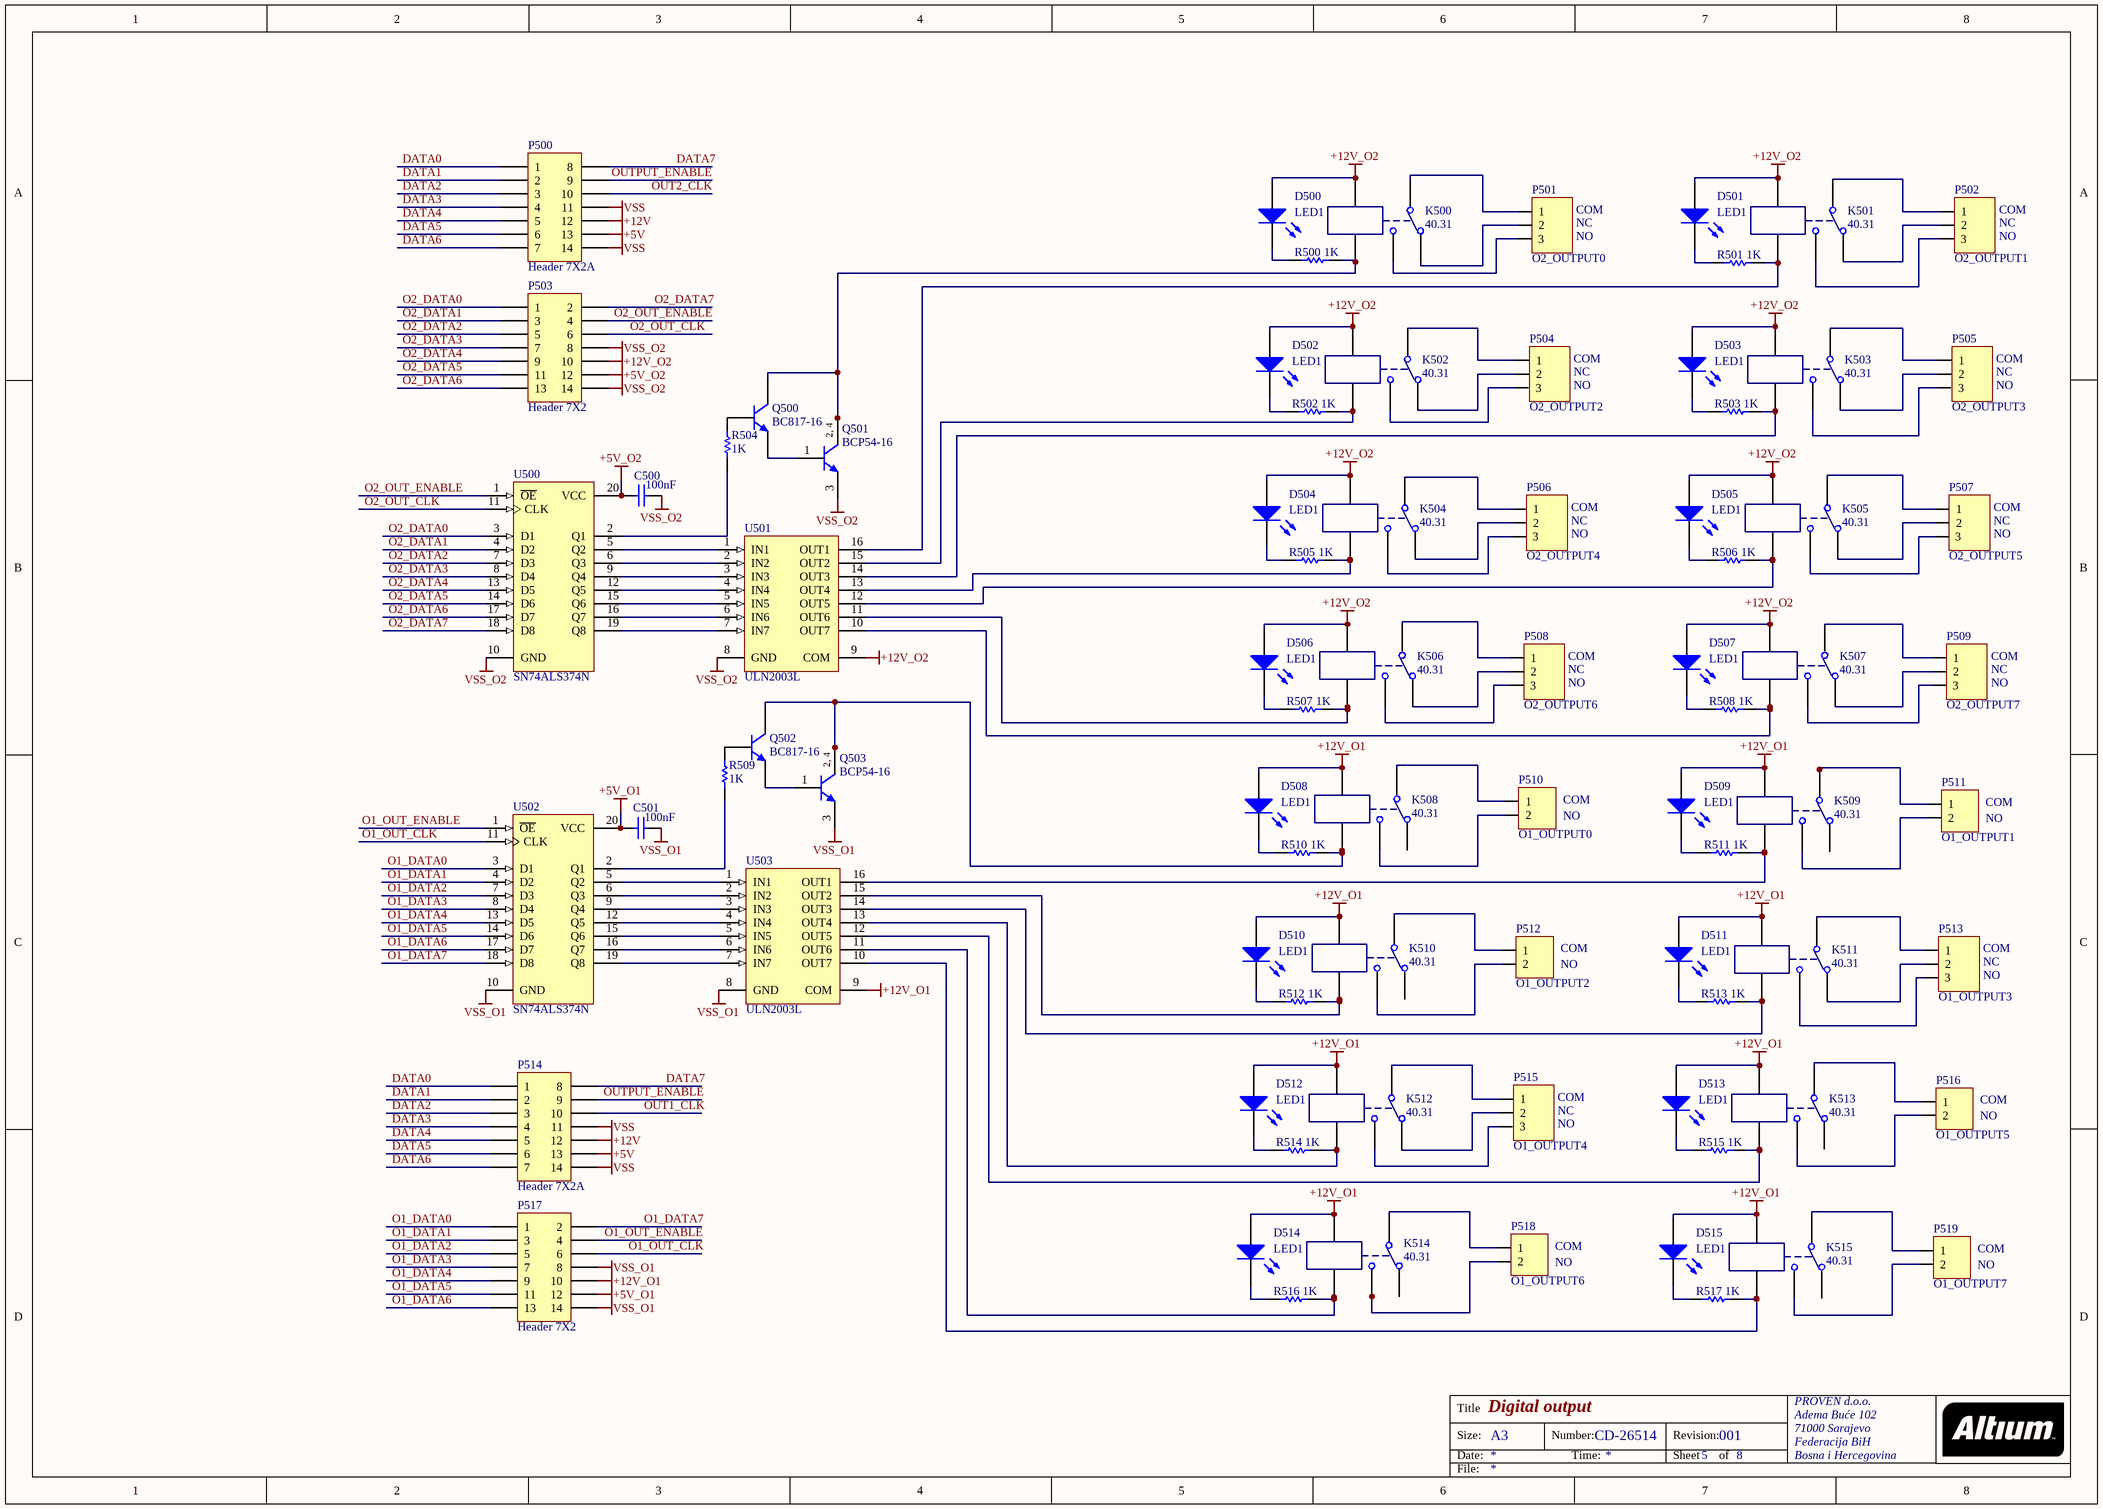
[diagram p4: DIGITAL_OUTPUT.SchDoc]

### Parts
C500  value 100nF  [1206]
C501  value 100nF  [1206]
D500  LED1  [LED-1]
D501  LED1  [LED-1]
D502  LED1  [LED-1]
D503  LED1  [LED-1]
D504  LED1  [LED-1]
D505  LED1  [LED-1]
D506  LED1  [LED-1]
D507  LED1  [LED-1]
D508  LED1  [LED-1]
D509  LED1  [LED-1]
D510  LED1  [LED-1]
D511  LED1  [LED-1]
D512  LED1  [LED-1]
D513  LED1  [LED-1]
D514  LED1  [LED-1]
D515  LED1  [LED-1]
K500  40.31  [40.31 FINDER]
K501  40.31  [40.31 FINDER]
K502  40.31  [40.31 FINDER]
K503  40.31  [40.31 FINDER]
K504  40.31  [40.31 FINDER]
K505  40.31  [40.31 FINDER]
K506  40.31  [40.31 FINDER]
K507  40.31  [40.31 FINDER]
K508  40.31  [40.31 FINDER]
K509  40.31  [40.31 FINDER]
K510  40.31  [40.31 FINDER]
K511  40.31  [40.31 FINDER]
K512  40.31  [40.31 FINDER]
K513  40.31  [40.31 FINDER]
K514  40.31  [40.31 FINDER]
K515  40.31  [40.31 FINDER]
P500  Header 7X2A  [HDR2X7_CEN]
P501  O2_OUTPUT0  [TERMINAL BLOK]
P502  O2_OUTPUT1  [TERMINAL BLOK]
P503  Header 7X2  [HDR2X7]
P504  O2_OUTPUT2  [TERMINAL BLOK]
P505  O2_OUTPUT3  [TERMINAL BLOK]
P506  O2_OUTPUT4  [TERMINAL BLOK]
P507  O2_OUTPUT5  [TERMINAL BLOK]
P508  O2_OUTPUT6  [TERMINAL BLOK]
P509  O2_OUTPUT7  [TERMINAL BLOK]
P510  O1_OUTPUT0  [TERMINAL BLOK 2]
P511  O1_OUTPUT1  [TERMINAL BLOK 2]
P512  O1_OUTPUT2  [TERMINAL BLOK 2]
P513  O1_OUTPUT3  [TERMINAL BLOK]
P514  Header 7X2A  [HDR2X7_CEN]
P515  O1_OUTPUT4  [TERMINAL BLOK]
P516  O1_OUTPUT5  [TERMINAL BLOK 2]
P517  Header 7X2  [HDR2X7]
P518  O1_OUTPUT6  [TERMINAL BLOK 2]
P519  O1_OUTPUT7  [TERMINAL BLOK 2]
Q500  BC817-16  [SOT23_N]
Q501  BCP54-16  [SOT223_N]
Q502  BC817-16  [SOT23_N]
Q503  BCP54-16  [SOT223_N]
R500  1K  [ERA-0805]
R501  1K  [ERA-0805]
R502  1K  [ERA-0805]
R503  1K  [ERA-0805]
R504  1K  [ERA-0805]
R505  1K  [ERA-0805]
R506  1K  [ERA-0805]
R507  1K  [ERA-0805]
R508  1K  [ERA-0805]
R509  1K  [ERA-0805]
R510  1K  [ERA-0805]
R511  1K  [ERA-0805]
R512  1K  [ERA-0805]
R513  1K  [ERA-0805]
R514  1K  [ERA-0805]
R515  1K  [ERA-0805]
R516  1K  [ERA-0805]
R517  1K  [ERA-0805]
U500  SN74ALS374N  [N020D]
U501  ULN2003L  [L16_N]
U502  SN74ALS374N  [N020D]
U503  ULN2003L  [L16_N]

### Nets
+5V: P500.13 P514.13
+5V_O1: C501.1 P517.12 U502.20(VCC)
+5V_O2: C500.1 P503.12 U500.20(VCC)
+12V: P500.12 P514.12
+12V_O1: D508.1(A) D509.1(A) D510.1(A) D511.1(A) D512.1(A) D513.1(A) D514.1(A) D515.1(A) K508.1 K509.1 K510.1 K511.1 K512.1 K513.1 K514.1 K515.1 P517.10 U503.9(COM)
+12V_O2: D500.1(A) D501.1(A) D502.1(A) D503.1(A) D504.1(A) D505.1(A) D506.1(A) D507.1(A) K500.1 K501.1 K502.1 K503.1 K504.1 K505.1 K506.1 K507.1 P503.10 U501.9(COM)
VSS: P500.11 P500.14 P514.11 P514.14
VSS_O1: C501.2 P517.8 P517.14 Q503.3(E) U502.10(GND) U503.8(GND)
VSS_O2: C500.2 P503.8 P503.14 Q501.3(E) U500.10(GND) U501.8(GND)
DATA0: P500.1 P514.1
DATA1: P500.2 P514.2
DATA2: P500.3 P514.3
DATA3: P500.4 P514.4
DATA4: P500.5 P514.5
DATA5: P500.6 P514.6
DATA6: P500.7 P514.7
DATA7: P500.8 P514.8
O1_DATA0: P517.1 U502.3(D1)
O1_DATA1: P517.3 U502.4(D2)
O1_DATA2: P517.5 U502.7(D3)
O1_DATA3: P517.7 U502.8(D4)
O1_DATA4: P517.9 U502.13(D5)
O1_DATA5: P517.11 U502.14(D6)
O1_DATA6: P517.13 U502.17(D7)
O1_DATA7: P517.2 U502.18(D8)
O1_OUT_CLK: P517.6 U502.11(CLK)
O1_OUT_ENABLE: P517.4 U502.1(~{OE})
O2_DATA0: P503.1 U500.3(D1)
O2_DATA1: P503.3 U500.4(D2)
O2_DATA2: P503.5 U500.7(D3)
O2_DATA3: P503.7 U500.8(D4)
O2_DATA4: P503.9 U500.13(D5)
O2_DATA5: P503.11 U500.14(D6)
O2_DATA6: P503.13 U500.17(D7)
O2_DATA7: P503.2 U500.18(D8)
O2_OUT_CLK: P503.6 U500.11(CLK)
O2_OUT_ENABLE: P503.4 U500.1(~{OE})
OUT1_CLK: P514.10
OUT2_CLK: P500.10
OUTPUT_ENABLE: P500.9 P514.9
NetD500_2: D500.2(K) R500.1
NetD501_2: D501.2(K) R501.1
NetD502_2: D502.2(K) R502.1
NetD503_2: D503.2(K) R503.1
NetD504_2: D504.2(K) R505.1
NetD505_2: D505.2(K) R506.1
NetD506_2: D506.2(K) R507.1
NetD507_2: D507.2(K) R508.1
NetD508_2: D508.2(K) R510.1
NetD509_2: D509.2(K) R511.1
NetD510_2: D510.2(K) R512.1
NetD511_2: D511.2(K) R513.1
NetD512_2: D512.2(K) R514.1
NetD513_2: D513.2(K) R515.1
NetD514_2: D514.2(K) R516.1
NetD515_2: D515.2(K) R517.1
NetK500_2: K500.2 Q500.3(C) Q501.2(C) Q501.4(C) R500.2
NetK500_3: K500.3 P501.1
NetK500_4: K500.4 P501.3
NetK500_5: K500.5 P501.2
NetK501_2: K501.2 R501.2 U501.16(OUT1)
NetK501_3: K501.3 P502.1
NetK501_4: K501.4 P502.3
NetK501_5: K501.5 P502.2
NetK502_2: K502.2 R502.2 U501.15(OUT2)
NetK502_3: K502.3 P504.1
NetK502_4: K502.4 P504.3
NetK502_5: K502.5 P504.2
NetK503_2: K503.2 R503.2 U501.14(OUT3)
NetK503_3: K503.3 P505.1
NetK503_4: K503.4 P505.3
NetK503_5: K503.5 P505.2
NetK504_2: K504.2 R505.2 U501.13(OUT4)
NetK504_3: K504.3 P506.1
NetK504_4: K504.4 P506.3
NetK504_5: K504.5 P506.2
NetK505_2: K505.2 R506.2 U501.12(OUT5)
NetK505_3: K505.3 P507.1
NetK505_4: K505.4 P507.3
NetK505_5: K505.5 P507.2
NetK506_2: K506.2 R507.2 U501.11(OUT6)
NetK506_3: K506.3 P508.1
NetK506_4: K506.4 P508.3
NetK506_5: K506.5 P508.2
NetK507_2: K507.2 R508.2 U501.10(OUT7)
NetK507_3: K507.3 P509.1
NetK507_4: K507.4 P509.3
NetK507_5: K507.5 P509.2
NetK508_2: K508.2 Q502.3(C) Q503.2(C) Q503.4(C) R510.2
NetK508_3: K508.3 P510.1
NetK508_4: K508.4 P510.2
NetK509_2: K509.2 R511.2 U503.16(OUT1)
NetK509_3: K509.3 P511.1
NetK509_4: K509.4 P511.2
NetK510_2: K510.2 R512.2 U503.15(OUT2)
NetK510_3: K510.3 P512.1
NetK510_4: K510.4 P512.2
NetK511_2: K511.2 R513.2 U503.14(OUT3)
NetK511_3: K511.3 P513.1
NetK511_4: K511.4 P513.3
NetK511_5: K511.5 P513.2
NetK512_2: K512.2 R514.2 U503.13(OUT4)
NetK512_3: K512.3 P515.1
NetK512_4: K512.4 P515.3
NetK512_5: K512.5 P515.2
NetK513_2: K513.2 R515.2 U503.12(OUT5)
NetK513_3: K513.3 P516.1
NetK513_4: K513.4 P516.2
NetK514_2: K514.2 R516.2 U503.11(OUT6)
NetK514_3: K514.3 P518.1
NetK514_4: K514.4 P518.2
NetK515_2: K515.2 R517.2 U503.10(OUT7)
NetK515_3: K515.3 P519.1
NetK515_4: K515.4 P519.2
NetQ500_1: Q500.1(B) R504.2
NetQ500_2: Q500.2(E) Q501.1(B)
NetQ502_1: Q502.1(B) R509.2
NetQ502_2: Q502.2(E) Q503.1(B)
NetR504_1: R504.1 U500.2(Q1)
NetR509_1: R509.1 U502.2(Q1)
NetU500_5: U500.5(Q2) U501.1(IN1)
NetU500_6: U500.6(Q3) U501.2(IN2)
NetU500_9: U500.9(Q4) U501.3(IN3)
NetU500_12: U500.12(Q5) U501.4(IN4)
NetU500_15: U500.15(Q6) U501.5(IN5)
NetU500_16: U500.16(Q7) U501.6(IN6)
NetU500_19: U500.19(Q8) U501.7(IN7)
NetU502_5: U502.5(Q2) U503.1(IN1)
NetU502_6: U502.6(Q3) U503.2(IN2)
NetU502_9: U502.9(Q4) U503.3(IN3)
NetU502_12: U502.12(Q5) U503.4(IN4)
NetU502_15: U502.15(Q6) U503.5(IN5)
NetU502_16: U502.16(Q7) U503.6(IN6)
NetU502_19: U502.19(Q8) U503.7(IN7)

Not connected (* = marked no-connect by the designer): K508 5; K509 5; K510 5; K513 5; K514 5; K515 5

### Notes on the sheet
- (near P501) COM
- (near P501) NC
- (near P501) NO
- (near P502) COM
- (near P502) NC
- (near P502) NO
- (near P504) COM
- (near P504) NC
- (near P505) COM
- (near P505) NC
- (near P504) NO
- (near P505) NO
- (near P506) COM
- (near P507) COM
- (near P506) NC
- (near P506) NO
- (near P507) NC
- (near P507) NO
- (near P508) COM
- (near P508) NC
- (near P508) NO
- (near P509) COM
- (near P509) NC
- (near P509) NO
- (near P510) COM
- (near P510) NO
- (near P511) COM
- (near P511) NO
- (near P512) COM
- (near P512) NO
- (near P513) COM
- (near P513) NC
- (near P513) NO
- (near P515) COM
- (near P515) NC
- (near P515) NO
- (near P516) COM
- (near P516) NO
- (near P518) COM
- (near P519) COM
- (near P518) NO
- (near P519) NO
- Title
- Size:
- Date:
- A3
- Number:
- Time:
- Revision:
- Sheet
- of
- File:
- (in symbol BCP54-16) 2, 4

### Library data of the parts
C500 C501 = C1206: Ceramic Chip Capacitor - Standard; Published: 17-Jul-2002; LatestRevisionDate: 19-Mar-2004; LatestRevisionNote: Silkscreen size reduced.; DatasheetDocument: Mar-2001; PackageDocument: Mar-2001; PackageReference: 1206; Publisher: Altium Limited; Code_JEITA: 1206; Code_IPC: 3216 [1206]; ComponentLink1Description: Manufacturer Link; ComponentLink1URL: http://www.kemet.com/; ComponentLink2Description: Datasheet; ComponentLink2URL: http://www.kemet.com/kemet/web/homepage/kechome.nsf/vapubfilesname/F3102TA.pdf/$file/F3102TA.pdf
D500-D515 = LED1: Typical RED GaAs LED; Published: 8-Jun-2000; LatestRevisionDate: 08-Jul-2005; LatestRevisionNote: Mech Layer 1 removed.; PackageReference: LED-1; Publisher: Altium Limited; PackageDescription: LED; 2 Leads
K500-K515 = FINDER 40.31
P500 P514 = Header 7X2A: Header, 7-Pin, Dual row; LatestRevisionDate: 17-Jul-2002; LatestRevisionNote: Re-released for DXP Platform.; Publisher: Altium Limited
P501 P502 P504-P509 P513 P515 = Terminal blok 3 pina: Terminal blok
P503 P517 = Header 7X2: Header, 7-Pin, Dual row; LatestRevisionDate: 17-Jul-2002; LatestRevisionNote: Re-released for DXP Platform.; Publisher: Altium Limited
P510-P512 P516 P518 P519 = Terminal blok 2 pina: Terminal blok 2
Q500 Q502 = BC817-16: NPN General-purpose Transistor; Published: 17-Sep-2003; LatestRevisionDate: 12-Dec-2006; LatestRevisionNote: IPC-7351 Footprint Added.; DatasheetVersion: Jun-1999; PackageVersion: May-1999; PackageReference: SOT23; Publisher: Altium Limited; PackageDescription: 3-Pin SOT-23 Package 0.95 mm Pitch, 2.3 mm Lead Span; ComponentLink1Description: Manufacturer Link; ComponentLink1URL: http://www.semiconductors.philips.com/; ComponentLink2Description: Datasheet; ComponentLink2URL: http://www.semiconductors.philips.com/acrobat/datasheets/BC817_BC817W_BC337_5.pdf
Q501 Q503 = BCP54-16: NPN Medium Power Transistor; Published: 17-Sep-2003; LatestRevisionDate: 12-Dec-2006; LatestRevisionNote: IPC-7351 Footprint Added.; DatasheetVersion: 10-Oct-2001; PackageVersion: Aug-2001; PackageReference: SOT223; Publisher: Altium Limited; PackageDescription: 4-Pin SOT-223 Package 2.3 mm Pitch, 7 mm Lead Span; ComponentLink1Description: Manufacturer Link; ComponentLink1URL: http://www.semiconductors.philips.com/; ComponentLink2Description: Datasheet; ComponentLink2URL: http://www.semiconductors.philips.com/acrobat/datasheets/BC635_BCP54_BCX54_6.pdf
R500-R517 = ERAS: as R200 on sheet ANALOG_OUTPUT; Published: 17-Dec-2003; LatestRevisionDate: 19-Mar-2004; LatestRevisionNote: Silkscreen size reduced.; PackageDocument: Mar-2003; PackageReference: ERA-0805; Publisher: Altium Limited; Code_IPC: 2012 [0805]; ComponentLink1Description: Manufacturer Link; ComponentLink1URL: http://www.panasonic.com/industrial/components/resistive_products.htm; ComponentLink2Description: Datasheet; ComponentLink2URL: http://www.panasonic.com/industrial/components/pdf/AOF0000CE1.pdf
U500 U502 = SN74ALS374N: Octal D-Type Edge-Triggered Flip-Flop with 3-State Outputs; Published: 8-Jun-2000; LatestRevisionDate: 04-Mar-2005; LatestRevisionNote: Stylized 3D Model Added.; DatasheetVersion: May-1986; PackageVersion: Oct-1995; PackageReference: N020D; Publisher: Altium Limited; PackageDescription: DIP; 20 Leads; Row Spacing 7.62 mm; Pitch 2.54 mm; ComponentLink1Description: Manufacturer Link; ComponentLink1URL: http://www.ti.com/
U501 U503 = ULN2003L: High-Voltage, High-Current Darlington Array; Published: 13-Oct-2000; LatestRevisionDate: 13-Apr-2006; LatestRevisionNote: IPC-7351 Footprint Added.; DatasheetVersion: 1998; PackageReference: L16; Publisher: Altium Limited; PackageDescription: 16-Pin Small Outline Integrated Circuit 1.27 mm Pitch; Code_JEDEC: MS-012-AC; Code_IPC: SOIC127P600-16; ComponentLink1Description: Manufacturer Link; ComponentLink1URL: http://www.allegromicro.com/